# Altium schematic sheet VTL Sensor System.SchDoc
size A4
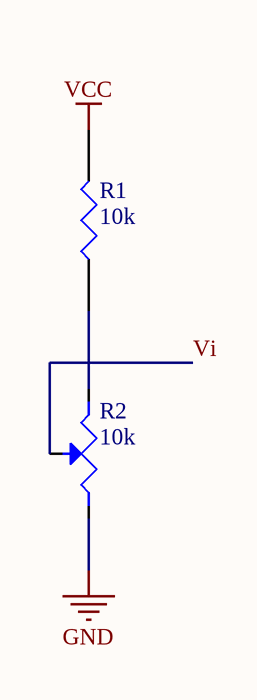
[diagram p0: VTL Sensor System.SchDoc]

## Parts
R1  10k  [AXIAL-0.4]
R2  10k  [VR-5]

## Nets
GND: R2.1
VCC: R1.2
Vi: R2.3(W)
NetR1_1: R1.1 R2.2

## Library data of the parts
R1 = RES1
R2 = POT1: Potentiometer